# Altium schematic sheet J3.SchDoc
size A4; CompanyName: Technische Hochschule Nürnberg Georg Simon Ohm; Organization: UltraZohm; Address1: Kesslerplatz 12; Address2: 90489 Nürnberg; Address3: GERMANY; SheetNumber: 5; SheetTotal: 36; Website: www.ultrazohm.com
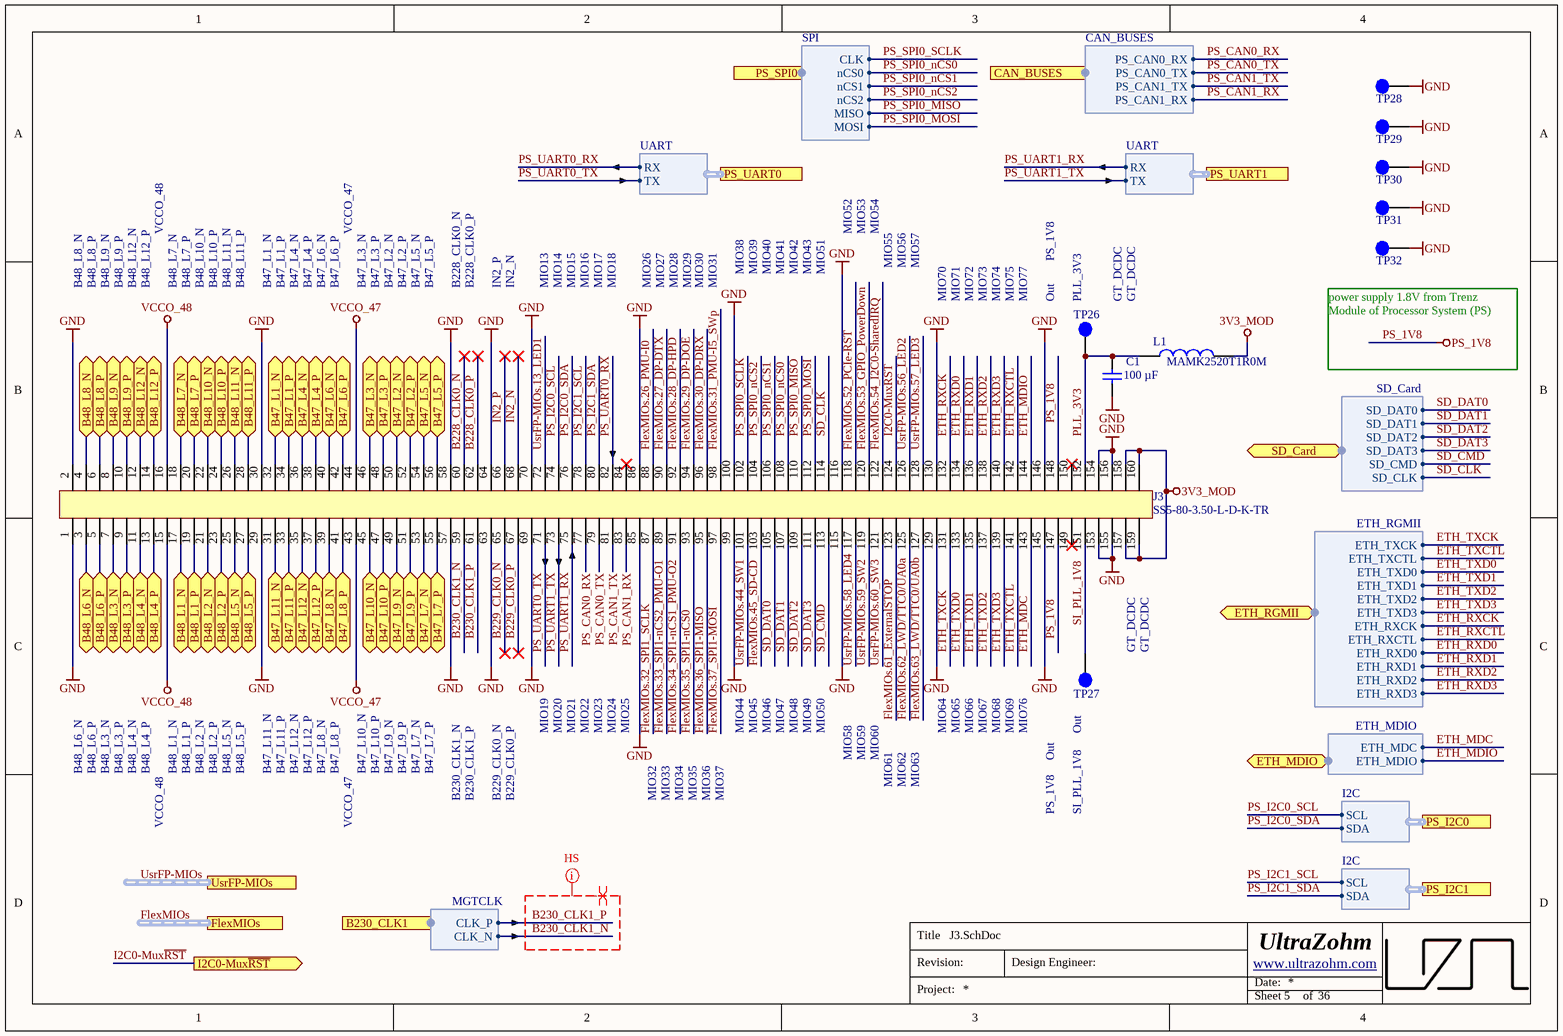
[diagram p0: J3.SchDoc]

## Parts
C1  100 µF  [C_1206_TE]
J3  SS5-80-3.50-L-D-K-TR  [SS5-80-3.50-L-D-K-TR]
L1  MAMK2520T1R0M  [INDC2520X120N]
TP26  Testpoint 1mm  [TP_1mm]  (value not drawn)  (no BOM)
TP27  Testpoint 1mm  [TP_1mm]  (value not drawn)  (no BOM)
TP28  Testpoint 1mm  [TP_1mm]  (value not drawn)  (no BOM)
TP29  Testpoint 1mm  [TP_1mm]  (value not drawn)  (no BOM)
TP30  Testpoint 1mm  [TP_1mm]  (value not drawn)  (no BOM)
TP31  Testpoint 1mm  [TP_1mm]  (value not drawn)  (no BOM)
TP32  Testpoint 1mm  [TP_1mm]  (value not drawn)  (no BOM)

## Ports
B47_L1_N (bidir), B47_L1_P (bidir), B47_L2_N (bidir), B47_L2_P (bidir), B47_L3_N (bidir), B47_L3_P (bidir), B47_L4_N (bidir), B47_L4_P (bidir), B47_L5_N (bidir), B47_L5_P (bidir), B47_L6_N (bidir), B47_L6_P (bidir), B47_L7_N (bidir), B47_L7_P (bidir), B47_L8_N (bidir), B47_L8_P (bidir), B47_L9_N (bidir), B47_L9_P (bidir), B47_L10_N (bidir), B47_L10_P (bidir), B47_L11_N (bidir), B47_L11_P (bidir), B47_L12_N (bidir), B47_L12_P (bidir), B48_L1_N (bidir), B48_L1_P (bidir), B48_L2_N (bidir), B48_L2_P (bidir), B48_L3_N (bidir), B48_L3_P (bidir), B48_L4_N (bidir), B48_L4_P (bidir), B48_L5_N (bidir), B48_L5_P (bidir), B48_L6_N (bidir), B48_L6_P (bidir), B48_L7_N (bidir), B48_L7_P (bidir), B48_L8_N (bidir), B48_L8_P (bidir), B48_L9_N (bidir), B48_L9_P (bidir), B48_L10_N (bidir), B48_L10_P (bidir), B48_L11_N (bidir), B48_L11_P (bidir), B48_L12_N (bidir), B48_L12_P (bidir), B230_CLK1 (harness MGTCLK), CAN_BUSES (harness CAN_BUSES), ETH_MDIO (bidir, harness ETH_MDIO), ETH_RGMII (bidir, harness ETH_RGMII), FlexMIOs (harness FlexMIOs), I2C0-Mux~{RST} (out), PS_I2C0 (harness I2C), PS_I2C1 (harness I2C), PS_SPI0 (harness SPI), PS_UART0 (harness UART), PS_UART1 (harness UART), SD_Card (bidir, harness SD_Card), UsrFP-MIOs (harness UsrFP-MIOs)

## Harnesses
ETH_RGMII: ETH_TXCK, ETH_TXCTL, ETH_TXD0, ETH_TXD1, ETH_TXD2, ETH_TXD3, ETH_RXCK, ETH_RXCTL, ETH_RXD0, ETH_RXD1, ETH_RXD2, ETH_RXD3
SD_Card: SD_DAT0, SD_DAT1, SD_DAT2, SD_DAT3, SD_CMD, SD_CLK
ETH_MDIO: ETH_MDC, ETH_MDIO
SPI: CLK, nCS0, MISO, MOSI, nCS1, nCS2
CAN_BUSES: PS_CAN0_RX, PS_CAN1_RX, PS_CAN1_TX, PS_CAN0_TX
I2C: SCL, SDA
UART: RX, TX
MGTCLK: CLK_N, CLK_P

## Nets
3V3_MOD: J3.157 J3.158 J3.159 J3.160 L1.2
GND: C1.2 J3.1 J3.2 J3.29 J3.30 J3.57 J3.58 J3.63 J3.64 J3.69 J3.70 J3.85 J3.86 J3.99 J3.100 J3.115 J3.116 J3.129 J3.130 J3.145 J3.146 J3.153 J3.154 J3.155 J3.156 TP28.1 TP29.1 TP30.1 TP31.1 TP32.1
PS_1V8: J3.147 J3.148
VCCO_47: J3.43 J3.44
VCCO_48: J3.15 J3.16
B47_L1_N: J3.32 ; port B47_L1_N
B47_L1_P: J3.34 ; port B47_L1_P
B47_L2_N: J3.50 ; port B47_L2_N
B47_L2_P: J3.52 ; port B47_L2_P
B47_L3_N: J3.46 ; port B47_L3_N
B47_L3_P: J3.48 ; port B47_L3_P
B47_L4_N: J3.36 ; port B47_L4_N
B47_L4_P: J3.38 ; port B47_L4_P
B47_L5_N: J3.54 ; port B47_L5_N
B47_L5_P: J3.56 ; port B47_L5_P
B47_L6_N: J3.40 ; port B47_L6_N
B47_L6_P: J3.42 ; port B47_L6_P
B47_L7_N: J3.53 ; port B47_L7_N
B47_L7_P: J3.55 ; port B47_L7_P
B47_L8_N: J3.39 ; port B47_L8_N
B47_L8_P: J3.41 ; port B47_L8_P
B47_L9_N: J3.49 ; port B47_L9_N
B47_L9_P: J3.51 ; port B47_L9_P
B47_L10_N: J3.45 ; port B47_L10_N
B47_L10_P: J3.47 ; port B47_L10_P
B47_L11_N: J3.31 ; port B47_L11_N
B47_L11_P: J3.33 ; port B47_L11_P
B47_L12_N: J3.35 ; port B47_L12_N
B47_L12_P: J3.37 ; port B47_L12_P
B48_L1_N: J3.17 ; port B48_L1_N
B48_L1_P: J3.19 ; port B48_L1_P
B48_L2_N: J3.21 ; port B48_L2_N
B48_L2_P: J3.23 ; port B48_L2_P
B48_L3_N: J3.7 ; port B48_L3_N
B48_L3_P: J3.9 ; port B48_L3_P
B48_L4_N: J3.11 ; port B48_L4_N
B48_L4_P: J3.13 ; port B48_L4_P
B48_L5_N: J3.25 ; port B48_L5_N
B48_L5_P: J3.27 ; port B48_L5_P
B48_L6_N: J3.3 ; port B48_L6_N
B48_L6_P: J3.5 ; port B48_L6_P
B48_L7_N: J3.18 ; port B48_L7_N
B48_L7_P: J3.20 ; port B48_L7_P
B48_L8_N: J3.4 ; port B48_L8_N
B48_L8_P: J3.6 ; port B48_L8_P
B48_L9_N: J3.8 ; port B48_L9_N
B48_L9_P: J3.10 ; port B48_L9_P
B48_L10_N: J3.22 ; port B48_L10_N
B48_L10_P: J3.24 ; port B48_L10_P
B48_L11_N: J3.26 ; port B48_L11_N
B48_L11_P: J3.28 ; port B48_L11_P
B48_L12_N: J3.12 ; port B48_L12_N
B48_L12_P: J3.14 ; port B48_L12_P
B228_CLK0_N: J3.60
B228_CLK0_P: J3.62
B229_CLK0_N: J3.65
B229_CLK0_P: J3.67
B230_CLK1_N: J3.59 ; port B230_CLK1.CLK_N
B230_CLK1_P: J3.61 ; port B230_CLK1.CLK_P
ETH_MDC: J3.143 ; port ETH_MDIO.ETH_MDC
ETH_MDIO: J3.144 ; port ETH_MDIO.ETH_MDIO
ETH_RXCK: J3.132 ; port ETH_RGMII.ETH_RXCK
ETH_RXCTL: J3.142 ; port ETH_RGMII.ETH_RXCTL
ETH_RXD0: J3.134 ; port ETH_RGMII.ETH_RXD0
ETH_RXD1: J3.136 ; port ETH_RGMII.ETH_RXD1
ETH_RXD2: J3.138 ; port ETH_RGMII.ETH_RXD2
ETH_RXD3: J3.140 ; port ETH_RGMII.ETH_RXD3
ETH_TXCK: J3.131 ; port ETH_RGMII.ETH_TXCK
ETH_TXCTL: J3.141 ; port ETH_RGMII.ETH_TXCTL
ETH_TXD0: J3.133 ; port ETH_RGMII.ETH_TXD0
ETH_TXD1: J3.135 ; port ETH_RGMII.ETH_TXD1
ETH_TXD2: J3.137 ; port ETH_RGMII.ETH_TXD2
ETH_TXD3: J3.139 ; port ETH_RGMII.ETH_TXD3
FlexMIOs.26_PMU-I0: J3.88
FlexMIOs.27_DP-DTX: J3.90
FlexMIOs.28_DP-HPD: J3.92
FlexMIOs.29_DP-DOE: J3.94
FlexMIOs.30_DP-DRX: J3.96
FlexMIOs.31_PMU-I5_SWp: J3.98
FlexMIOs.32_SPI1_SCLK: J3.87
FlexMIOs.33_SPI1-nCS2_PMU-O1: J3.89
FlexMIOs.34_SPI1-nCS1_PMU-O2: J3.91
FlexMIOs.35_SPI1-nCS0: J3.93
FlexMIOs.36_SPI1-MISO: J3.95
FlexMIOs.37_SPI1-MOSI: J3.97
FlexMIOs.45_SD-CD: J3.103
FlexMIOs.52_PCIe-~{RST}: J3.118
FlexMIOs.53_GPIO_PowerDown: J3.120
FlexMIOs.54_I2C0-Shared~{IRQ}: J3.122
FlexMIOs.61_ExternalSTOP: J3.123
FlexMIOs.62_LWD/TTC0/UA0a: J3.125
FlexMIOs.63_LWD/TTC0/UA0b: J3.127
I2C0-Mux~{RST}: J3.124 ; port I2C0-Mux~{RST}
IN2_N: J3.68
IN2_P: J3.66
PLL_3V3: C1.1 J3.152 L1.1 TP26.1
PS_CAN0_RX: J3.77 ; port CAN_BUSES.PS_CAN0_RX
PS_CAN0_TX: J3.79 ; port CAN_BUSES.PS_CAN0_TX
PS_CAN1_RX: J3.83 ; port CAN_BUSES.PS_CAN1_RX
PS_CAN1_TX: J3.81 ; port CAN_BUSES.PS_CAN1_TX
PS_I2C0_SCL: J3.74 ; port PS_I2C0.SCL
PS_I2C0_SDA: J3.76 ; port PS_I2C0.SDA
PS_I2C1_SCL: J3.78 ; port PS_I2C1.SCL
PS_I2C1_SDA: J3.80 ; port PS_I2C1.SDA
PS_SPI0_MISO: J3.110 ; port PS_SPI0.MISO
PS_SPI0_MOSI: J3.112 ; port PS_SPI0.MOSI
PS_SPI0_nCS0: J3.108 ; port PS_SPI0.nCS0
PS_SPI0_nCS1: J3.106 ; port PS_SPI0.nCS1
PS_SPI0_nCS2: J3.104 ; port PS_SPI0.nCS2
PS_SPI0_SCLK: J3.102 ; port PS_SPI0.CLK
PS_UART0_RX: J3.82 ; port PS_UART0.RX
PS_UART0_TX: J3.71 ; port PS_UART0.TX
PS_UART1_RX: J3.75 ; port PS_UART1.RX
PS_UART1_TX: J3.73 ; port PS_UART1.TX
SD_CLK: J3.114 ; port SD_Card.SD_CLK
SD_CMD: J3.113 ; port SD_Card.SD_CMD
SD_DAT0: J3.105 ; port SD_Card.SD_DAT0
SD_DAT1: J3.107 ; port SD_Card.SD_DAT1
SD_DAT2: J3.109 ; port SD_Card.SD_DAT2
SD_DAT3: J3.111 ; port SD_Card.SD_DAT3
SI_PLL_1V8: J3.151 TP27.1
UsrFP-MIOs.13_LED1: J3.72
UsrFP-MIOs.44_SW1: J3.101
UsrFP-MIOs.56_LED2: J3.126
UsrFP-MIOs.57_LED3: J3.128
UsrFP-MIOs.58_LED4: J3.117
UsrFP-MIOs.59_SW2: J3.119
UsrFP-MIOs.60_SW3: J3.121

Not connected (* = marked no-connect by the designer): J3 84* 149* 150*

## Buses and harness runs
harness FlexMIOs = port FlexMIOs
harness UsrFP-MIOs = port UsrFP-MIOs

## Layout directives
differential pair: B230_CLK1_N, B230_CLK1_P
net class HS: B230_CLK1_N, B230_CLK1_P

## Notes on the sheet
- VCCO_48
- VCCO_47
- MIO52
- MIO53
- MIO54
- B48_L8_N
- B48_L8_P
- B48_L9_N
- B48_L9_P
- B48_L12_N
- B48_L12_P
- B48_L7_N
- B48_L7_P
- B48_L10_N
- B48_L10_P
- B48_L11_N
- B48_L11_P
- B47_L1_N
- B47_L1_P
- B47_L4_N
- B47_L4_P
- B47_L6_N
- B47_L6_P
- B47_L3_N
- B47_L3_P
- B47_L2_N
- B47_L2_P
- B47_L5_N
- B47_L5_P
- B228_CLK0_N
- B228_CLK0_P
- IN2_P
- IN2_N
- MIO13
- MIO14
- MIO15
- MIO16
- MIO17
- MIO18
- MIO26
- MIO27
- MIO28
- MIO29
- MIO30
- MIO31
- MIO38
- MIO39
- MIO40
- MIO41
- MIO42
- MIO43
- MIO51
- MIO55
- MIO56
- MIO57
- MIO70
- MIO71
- MIO72
- MIO73
- MIO74
- MIO75
- MIO77
- PS_1V8
- (near TP26) Out
- (near TP26) PLL_3V3
- (near TP26) GT_DCDC
- GT_DCDC
- (near TP32) power supply 1.8V from Trenz Module of Processor System (PS)
- (near TP27) GT_DCDC
- B48_L6_N
- B48_L6_P
- B48_L3_N
- B48_L3_P
- B48_L4_N
- B48_L4_P
- B48_L1_N
- B48_L1_P
- B48_L2_N
- B48_L2_P
- B48_L5_N
- B48_L5_P
- B47_L11_N
- B47_L11_P
- B47_L12_N
- B47_L12_P
- B47_L8_N
- B47_L8_P
- B47_L10_N
- B47_L10_P
- B47_L9_N
- B47_L9_P
- B47_L7_N
- B47_L7_P
- MIO19
- MIO20
- MIO21
- MIO22
- MIO23
- MIO24
- MIO25
- MIO44
- MIO45
- MIO46
- MIO47
- MIO48
- MIO49
- MIO50
- MIO58
- MIO59
- MIO60
- MIO61
- MIO62
- MIO63
- MIO64
- MIO65
- MIO66
- MIO67
- MIO68
- MIO69
- MIO76
- Out
- (near TP27) Out
- B230_CLK1_N
- B230_CLK1_P
- B229_CLK0_N
- B229_CLK0_P
- MIO32
- MIO33
- MIO34
- MIO35
- MIO36
- MIO37
- SI_PLL_1V8
- Title
- Revision:
- Design Engineer:
- Date:
- Project:
- Sheet
- of

## Library data of the parts
C1 = CL31A107MQHNNNE: 6.3V 100uF X5R ±20% 1206 Multilayer Ceramic Capacitors MLCC; Manufacturer: Samsung Electro-Mechanics; Created from: MGeier; Tolerance: 20%; Value: 100 µF; Manufacturer Part Number: CL31A107MQHNNNE; PartID: 152; Created On: 02/08/2024 16:00:00; ComponentLink1Description: Datasheet; ComponentLink1URL: https://wmsc.lcsc.com/wmsc/upload/file/pdf/v2/lcsc/2304140030_Samsung-Electro-Mechanics-CL31A107MQHNNNE_C15008.pdf; Component Type: Capacitor 1206; Device Package: 1206; Last Updated: 02/08/2024 16:00:00; Mounting Type: SMD; Operating Temperature: -55 - 85°C; Series: CL; Supplier 1: LCSC; Supplier Part Number 1: C15008; Type: Capacitor; Voltage Rating: 6.3 V; Live Cycle Status: 1; LCSC Part Number: C15008; Stock number: not stored
J3 = SS5-80-3.50-L-D-K-TR: 0.5 mm Ultra Fine Pitch Socket REF192552-01, 160 Pins; Manufacturer: SAMTEC; Created from: MGremer; Number of positions: 80; Manufacturer Part Number: SS5-80-3.50-L-D-K-TR; PartID: 27; Created On: 01/12/2020 18:14:32; ComponentLink1Description: Homepage; ComponentLink1URL: https://www.samtec.com/de/products/ss5-80-3.50-l-d-k-tr; Component Type: Samtec Connector; Device Package: Connector; Last Updated: 11/07/2024 09:43:54; Mounting Type: SMD; Supplier 1: SAMTEC; Supplier Part Number 1: SS5-80-3.50-L-D-K-TR; Type: Connector; Live Cycle Status: 1; Number of rows: 2; LCSC Part Number: C5292077; Stock number: not stored
L1 = MAMK2520T1R0M: 1uH @2MHz ±20%, 2.7A, 59mOhm, 5040; Manufacturer: Taiyo Yuden; MF: EPCOS / TDK; DCR: 320m; Rated Current: 0.85 A; Type: Inductance SMD; Created from: FRosner; Value: 1uH; MPN: B82464G4154M; Supplier 1: Mouser; Supplier Part Number 1: 963-MAMK2520T1R0M; Manufacturer Part Number: MAMK2520T1R0M; PartID: 23; Created On: 05/09/2024 10:52:30; ComponentLink1Description: Datasheet; ComponentLink1URL: https://www.mouser.de/datasheet/2/396/wound10_e-1396630.pdf; Component Type: SMD Power Inductor; Device Package: 1008 (2520 metric); Last Updated: 05/09/2024 12:46:26; Mounting Type: SMD; Operating Temperature: -40°C to +105°C; Series: MA; Supplier 2: LCSC; Supplier Part Number 2: C92924; DC current: 2.7 A; Live Cycle Status: 1; LCSC Part Number: C92924; Stock number: not stored
TP26-TP32 = 25063: AN: 25063; Mixed: SMT